# EasyEDA Pro project ProProject_无线温湿度检测系统1_2024-10-27.epro, board PCB1
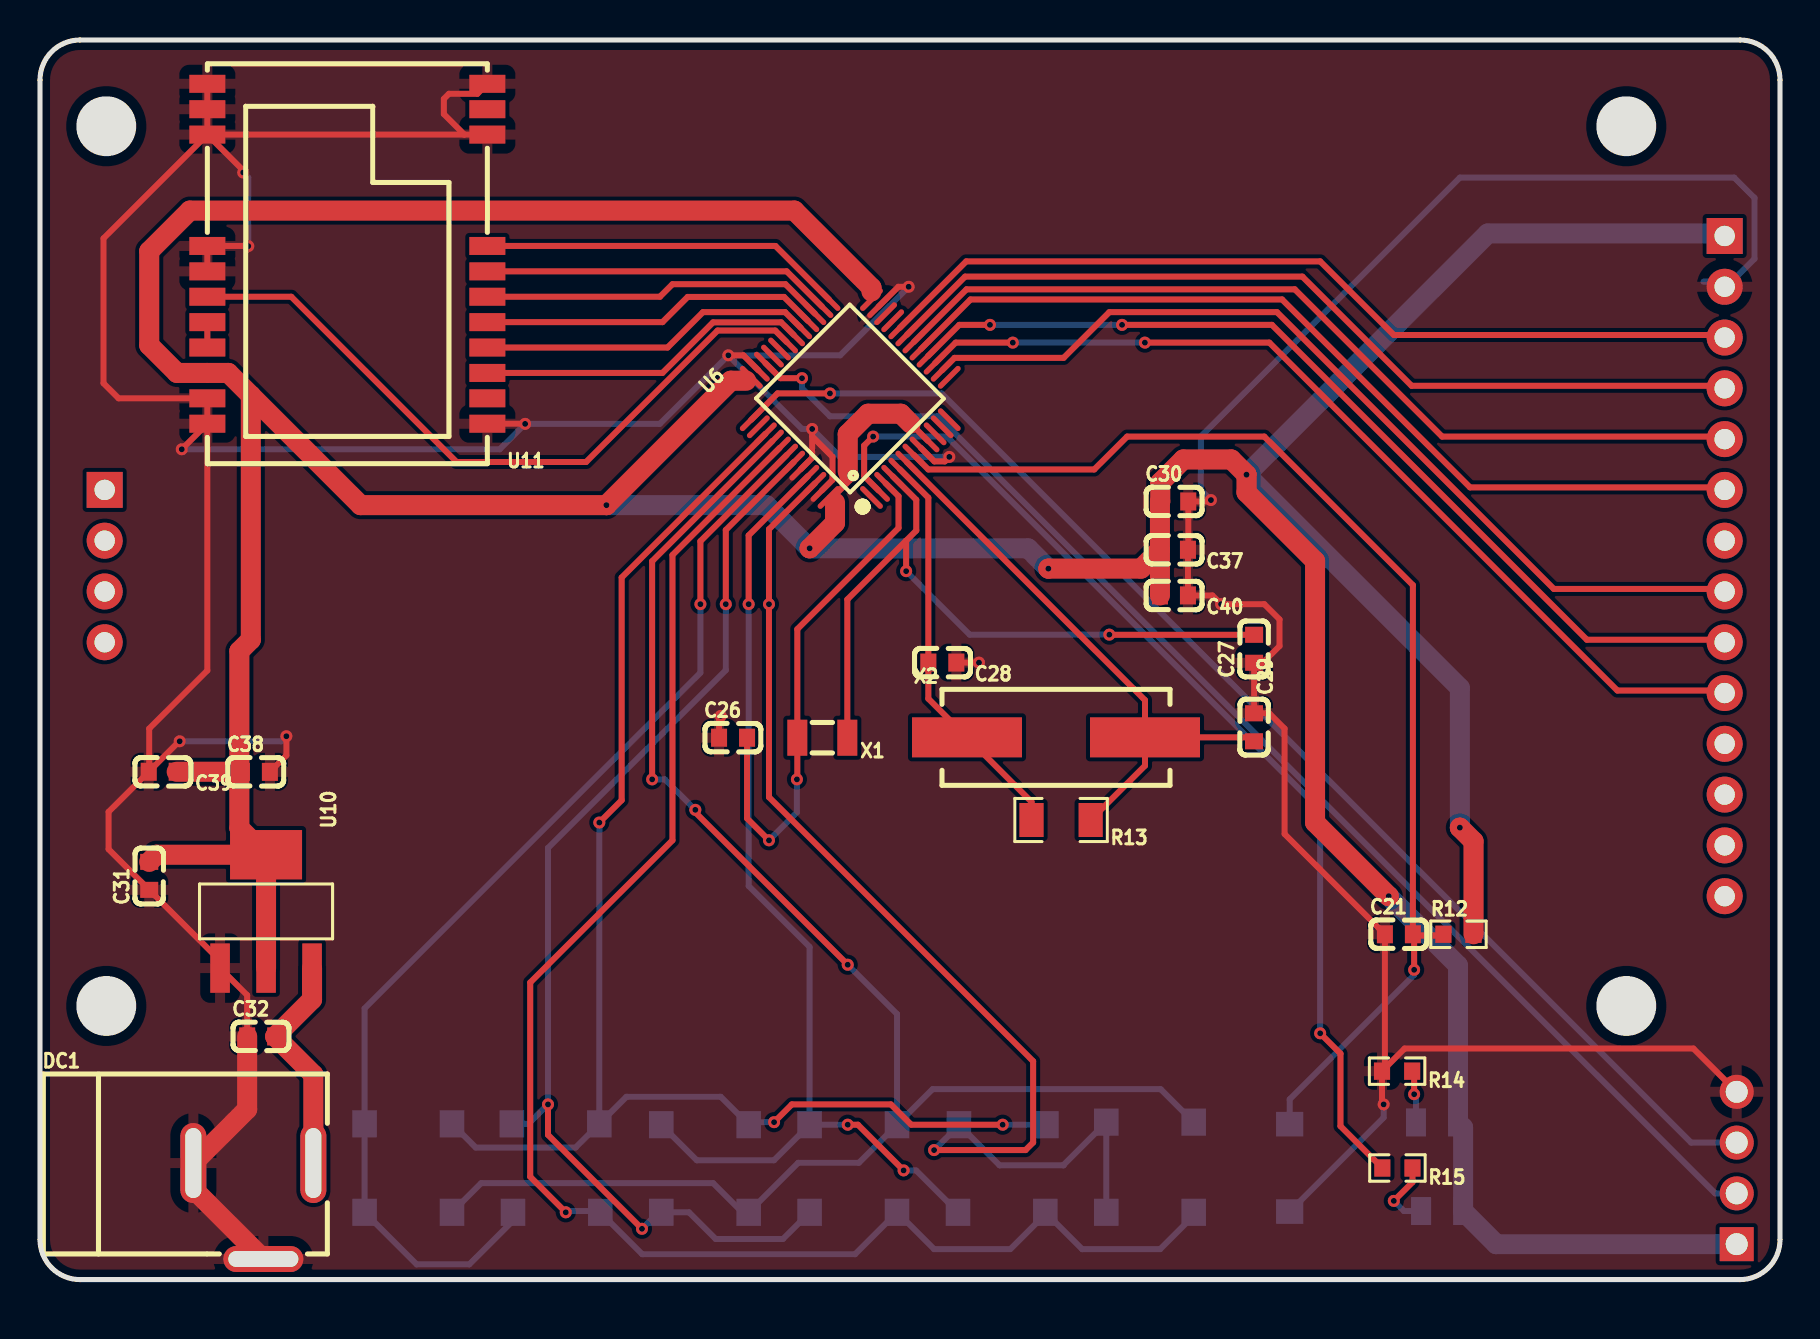
[diagram p9: board, top side]
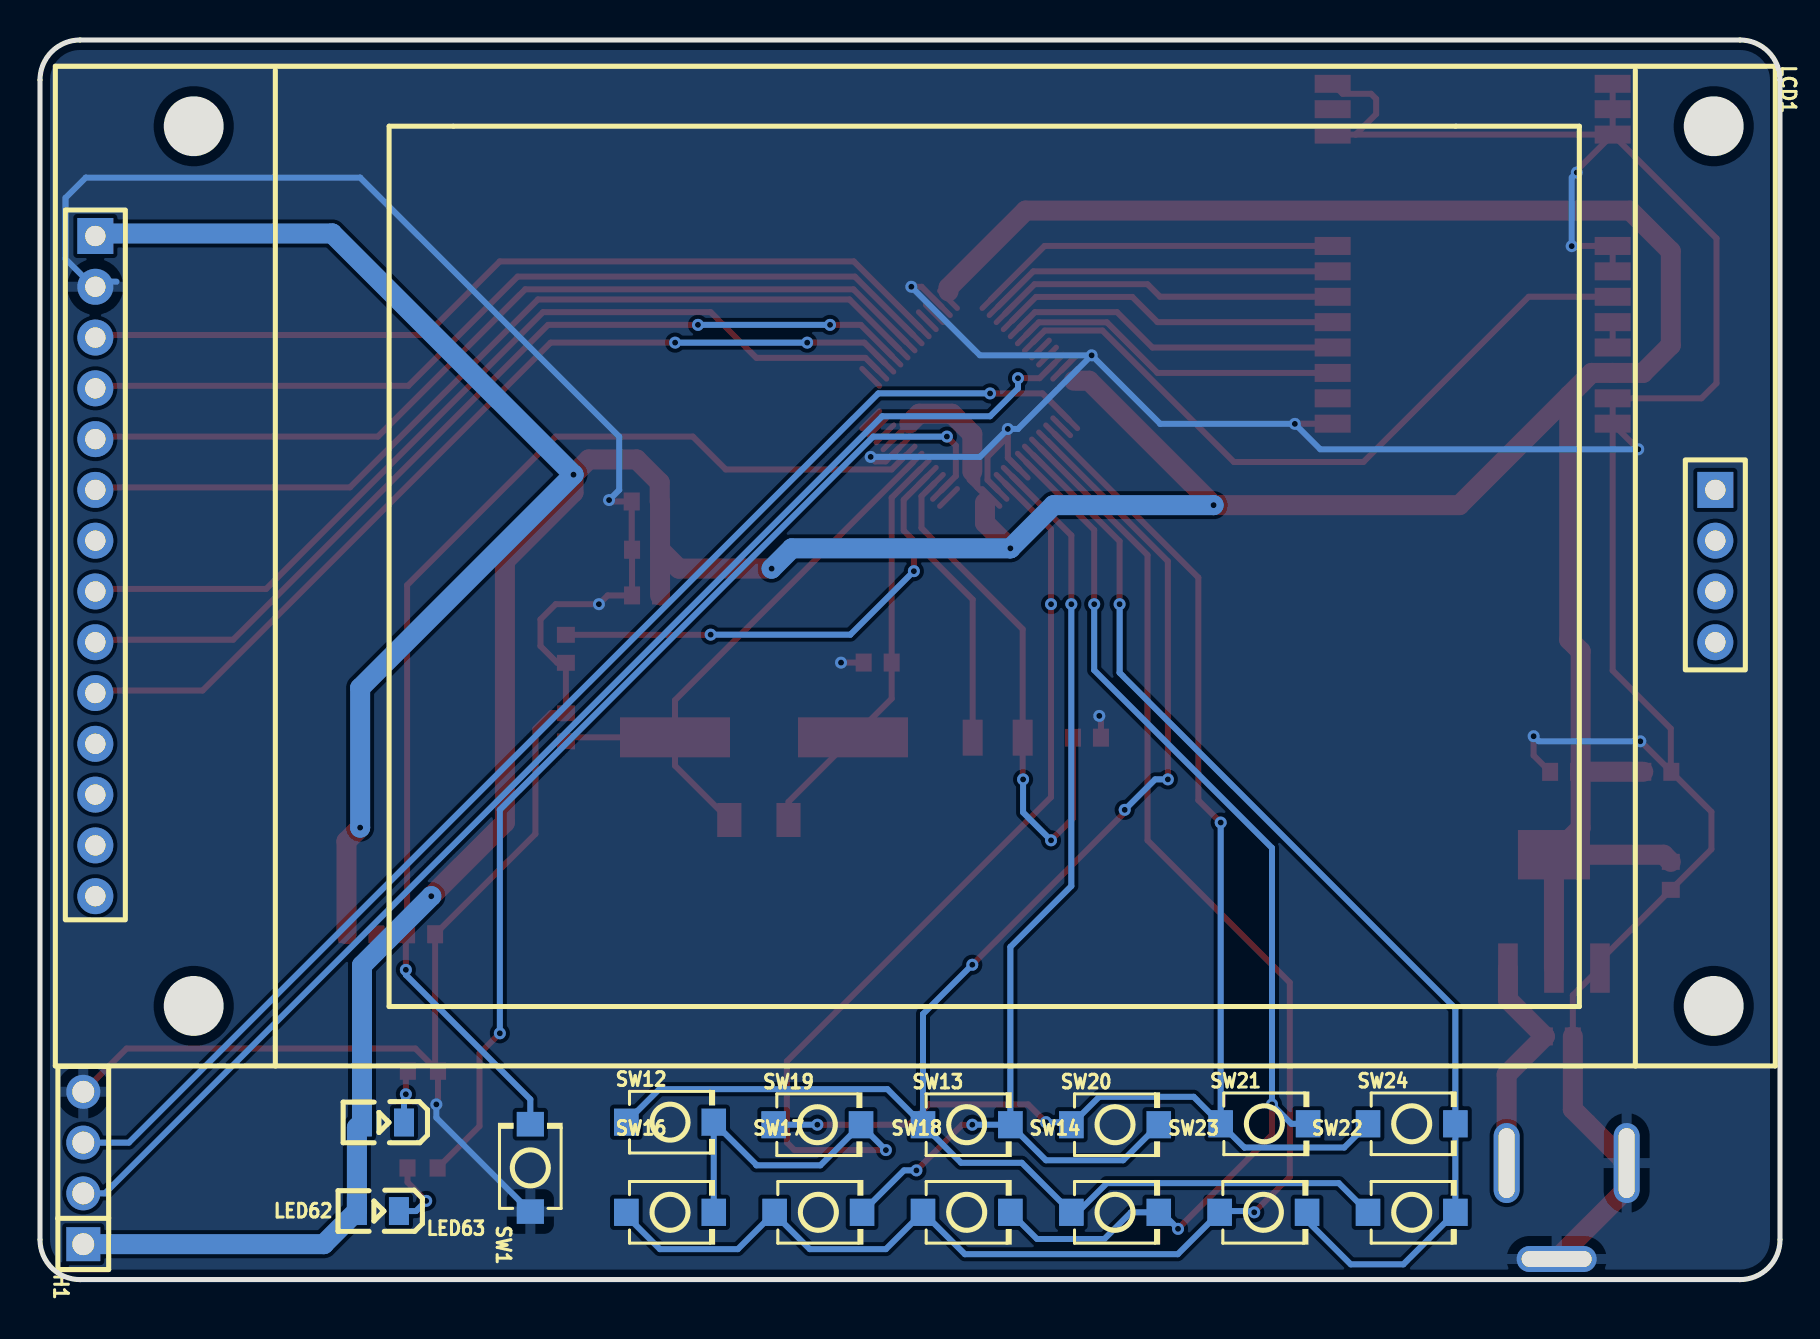
[diagram p10: board, bottom side, seen from below]

Outline 87 x 62 mm; copper layers: Top Layer, Inner1, Inner2, Bottom Layer. Coordinates in mm from the lower left corner of the outline.
Outline path: 0,60 0,2 arc(0.59,0.59) 2,0 85,0 arc(86.41,0.59) 87,2 87,60 arc(86.41,61.41) 85,62 2,62 arc(0.59,61.41) 0,60
Stack: Top Layer 0.035mm 外层铜厚1oz / Dielectric1 0.2104mm 7628 RC49% 8.6mil / Inner1 0.0152mm 内层铜厚 / Dielectric2 1.065mm 1.1mm H/HOZ 含铜 / Inner2 0.0152mm 内层铜厚 / Dielectric3 0.2104mm 7628 RC49% 8.6mil / Bottom Layer 0.035mm 外层铜厚1oz

## Design rules (mm)
template: JLCPCB Capability(Two Layers Board)
spacing copperThickness1oz (default): track to track 0.102, other pairs 0.152 to 0.3
spacing copperThickness2oz: track to track 0.203, other pairs 0.152 to 0.3
track width copperThickness1oz (default): min 0.127, default 0.254, max 2.54
track width copperThickness2oz: min 0.203, default 0.254, max 2.54
differential pair differentialPair (default): width min 0.127, default 0.254, max 2.54; gap min 0.152, default 0.152
via viaSize (default): diameter min 0.5, default 0.61, max 10; hole min 0.3, default 0.305, max 6.3

## Placement (name value [footprint] x y rotation side)
C21  1uF  [C0603]  67.94 17.27 0 top
C26  20pF  [C0603]  34.65 27.1 0 top
C27  20pF  [C0603]  60.71 31.55 90 top
C28  20pF  [C0603]  45.12 30.86 180 top
C29  20pF  [C0603]  60.7 27.62 270 top
C30  100nF  [C0603]  56.71 38.92 0 top
C31  1uF  [C0603]  5.46 20.19 90 top
C32  1uF  [C0603]  11.06 12.16 0 top
C37  100nF  [C0603]  56.7 36.5 180 top
C38  100nF  [C0603]  10.8 25.39 0 top
C39  100nF  [C0603]  6.14 25.4 180 top
C40  100nF  [C0603]  56.7 34.22 180 top
DC1  DC-005 2.0  [DC-IN-TH_DC-5520-1]  10.67 3.43 0 top
H1  烧录  [HDR-TH_4P-P2.54-V-M]  84.84 5.58 90 bottom
LCD1  HS280S010B  [LCD-TH_HS280S010B]  43.73 35.69 270 bottom
LED62  NCD0805R1  [LED0805-R-RD]  69.85 7.86 0 bottom
LED63  NCD0805R1  [LED0805-R-RD]  70.1 3.43 0 bottom
R12  10kΩ  [R0603]  70.92 17.27 0 top
R13  1mΩ  [R1206]  51.05 22.99 180 top
R14  510Ω  [R0603]  67.85 10.43 180 top
R15  510Ω  [R0603]  67.87 5.58 180 top
SW1  TS-1088R-02026  [SW-SMD_L3.9-W3.0-P4.45]  62.48 5.59 90 bottom
SW12  TS-1088-AR02016  [SW-SMD_L3.9-W3.0-P4.45]  55.5 7.87 180 bottom
SW13  TS-1088-AR02016  [SW-SMD_L3.9-W3.0-P4.45]  40.67 7.75 180 bottom
SW14  TS-1088-AR02016  [SW-SMD_L3.9-W3.0-P4.45]  33.25 3.37 180 bottom
SW16  TS-1088-AR02016  [SW-SMD_L3.9-W3.0-P4.45]  55.5 3.37 180 bottom
SW17  TS-1088-AR02016  [SW-SMD_L3.9-W3.0-P4.45]  48.08 3.37 180 bottom
SW18  TS-1088-AR02016  [SW-SMD_L3.9-W3.0-P4.45]  40.67 3.37 180 bottom
SW19  TS-1088-AR02016  [SW-SMD_L3.9-W3.0-P4.45]  48.13 7.75 180 bottom
SW20  TS-1088-AR02016  [SW-SMD_L3.9-W3.0-P4.45]  33.25 7.75 180 bottom
SW21  TS-1088-AR02016  [SW-SMD_L3.9-W3.0-P4.45]  25.78 7.79 180 bottom
SW22  TS-1088-AR02016  [SW-SMD_L3.9-W3.0-P4.45]  18.42 3.37 180 bottom
SW23  TS-1088-AR02016  [SW-SMD_L3.9-W3.0-P4.45]  25.83 3.37 180 bottom
SW24  TS-1088-AR02016  [SW-SMD_L3.9-W3.0-P4.45]  18.42 7.79 180 bottom
U6  STM32F103C8T6  [LQFP-48_L7.0-W7.0-P0.50-LS9.0-BL]  40.51 44.07 45 top
U10  AMS1117-3.3  [SOT-223-4_L6.5-W3.5-P2.30-LS7.0-BR]  11.3 18.42 270 top
U11  E22-400M22S  [WIRELM-SMD_E22-400M22S]  15.37 51.31 180 top
X1  32.768kHz  [FC-135R_L3.2-W1.5]  39.12 27.1 180 top
X2  8MHz  [CRYSTAL-SMD_L11.5-W4.8-LS12.7]  50.8 27.12 0 top

## Footprints (pads in the part's own frame, mm; a bottom-side part is the same pattern mirrored in y, then rotated)
C0603
  rect 0.8x0.9 smd: 1(-0.7,0) 2(0.7,0)
CRYSTAL-SMD_L11.5-W4.8-LS12.7
  rect 5.5x2 smd: 1(-4.45,0) 2(4.45,0)
DC-IN-TH_DC-5520-1
  oval 4x1.3 hole 3.5x0.8: 2(0.5,-2.4)
  oval 1.3x4 hole 0.8x3.5: 3(-3,2.4) 4(3,2.4)
FC-135R_L3.2-W1.5
  rect 1x1.8 smd: 1(-1.25,0) 2(1.25,0)
HDR-TH_4P-P2.54-V-M
  rect 1.7x1.7 hole 1.1: 1(-3.81,0)
  round 1.7 hole 1.1: 2(-1.27,0) 3(1.27,0) 4(3.81,0)
LCD-TH_HS280S010B
  rect 1.8x1.8 hole 1.02: 1(-16.51,-40.5) 15(-3.81,40.5)
  round 1.8 hole 1.02: 2(-13.97,-40.5) 3(-11.43,-40.5) 4(-8.89,-40.5) 5(-6.35,-40.5) 6(-3.81,-40.5) 7(-1.27,-40.5) 8(1.27,-40.5) 9(3.81,-40.5) 10(6.35,-40.5) 11(8.89,-40.5) 12(11.43,-40.5) 13(13.97,-40.5) 14(16.51,-40.5) 16(-1.27,40.5) 17(1.27,40.5) 18(3.81,40.5)
LED0805-R-RD
  rect 1x1.399 smd: 1(1.05,0) 2(-1.05,0)
LQFP-48_L7.0-W7.0-P0.50-LS9.0-BL
  oval 0.27x1.5 smd: 1(-2.75,-4.25) 2(-2.25,-4.25) 3(-1.75,-4.25) 4(-1.25,-4.25) 5(-0.75,-4.25) 6(-0.25,-4.25) 7(0.25,-4.25) 8(0.75,-4.25) 9(1.25,-4.25) 10(1.75,-4.25) 11(2.25,-4.25) 12(2.75,-4.25) 25(2.75,4.25) 26(2.25,4.25) 27(1.75,4.25) 28(1.25,4.25) 29(0.75,4.25) 30(0.25,4.25) 31(-0.25,4.25) 32(-0.75,4.25) 33(-1.25,4.25) 34(-1.75,4.25) 35(-2.25,4.25) 36(-2.75,4.25)
  oval 1.5x0.27 smd: 13(4.25,-2.75) 14(4.25,-2.25) 15(4.25,-1.75) 16(4.25,-1.25) 17(4.25,-0.75) 18(4.25,-0.25) 19(4.25,0.25) 20(4.25,0.75) 21(4.25,1.25) 22(4.25,1.75) 23(4.25,2.25) 24(4.25,2.75) 37(-4.25,2.75) 38(-4.25,2.25) 39(-4.25,1.75) 40(-4.25,1.25) 41(-4.25,0.75) 42(-4.25,0.25) 43(-4.25,-0.25) 44(-4.25,-0.75) 45(-4.25,-1.25) 46(-4.25,-1.75) 47(-4.25,-2.25) 48(-4.25,-2.75)
R0603
  rect 0.806x0.864 smd: 1(-0.753,0) 2(0.753,0)
R1206
  rect 1.208x1.701 smd: 1(-1.479,0) 2(1.479,0)
SOT-223-4_L6.5-W3.5-P2.30-LS7.0-BR
  rect 2.47x0.98 smd: 1(2.835,-2.3) 2(2.835,0) 3(2.835,2.3)
  rect 2.47x3.6 smd: 4(-2.835,0)
SW-SMD_L3.9-W3.0-P4.45
  rect 1.23x1.36 smd: 1(-2.185,0) 2(2.185,0)
WIRELM-SMD_E22-400M22S
  rect 1.8x0.9 smd: 1(7,-8.5) 2(7,-7.23) 3(7,-5.96) 4(7,-0.39) 5(7,0.88) 6(7,2.15) 7(7,3.42) 8(7,4.69) 9(7,5.96) 10(7,7.23) 11(7,8.5) 12(-7,8.5) 13(-7,7.23) 14(-7,5.96) 15(-7,4.69) 16(-7,3.42) 17(-7,2.15) 18(-7,0.88) 19(-7,-0.39) 20(-7,-5.96) 21(-7,-7.23) 22(-7,-8.5)

## Nets
As in the schematic.

Pads without a net: LCD1 7 11 12 13 14 15 16 17 18; U6 1 10 11 12 13 21 22 32 33 38; U11 13 21

## Via types
v1: diameter 1, hole 0.3, Top Layer to Bottom Layer, 6 vias
v2: diameter 0.6, hole 0.3, Top Layer to Bottom Layer, 46 vias

## Routing (per net, layer and track width the routed paths; a pad name or vN(x,y) marks a point on that pad's centre or on a via; arc(x,y) is an arc through that point)
12V: length 11.3
  Top Layer w1: U10.3 13.6,14.01 C32.2 13.67,10.25 DC1.4
GND: length 327.8
  Top Layer w0.3: v2(43.43,49.66) 42.92,49.66 41.93,48.67 ; 67.25,10.57 C21.1 62.23,22.29 62.23,27.56 61.47,28.32 C29.1 60.71,28.33 C27.1 61.14,30.85 61.98,31.69 61.98,33.02 61.21,33.78 v2(59.06,33.78) 58.62,34.22 C40.1 C37.1 57.41,36.52 57.41,38.92 58.48,38.92 v2(58.55,38.99) ; 67.25,10.57 R14.2 67.1,8.85 v2(67.18,8.76) ; 67.25,10.57 68.23,11.56 82.67,11.56 H1.4 ; 38.61,42.16 38.61,41.1 U6.44 ; 38.61,42.16 v2(38.61,42.55) ; 38.61,42.16 39.62,41.15 39.62,40 39.1,39.47 ; 5.46,25.43 6.96,26.92 v2(6.98,26.92) ; 5.46,25.43 C39.2 3.43,23.39 3.43,21.53 C31.1 9,15.95 U10.1 10.36,14.23 C32.1 ; 5.46,25.43 5.46,27.56 8.37,30.47 U11.11 ; v2(12.32,27.18) 12.32,26.22 C38.2 ; U11.1 U11.2 U11.3 ; v2(46.95,30.86) 46.95,30.86 C28.1 ; U11.11 U11.10 3.93,44.08 3.17,44.83 3.17,52.08 U11.3 ; U11.11 v2(7.09,41.53) ; 21.22,57.27 U11.20 ; 21.22,57.27 20.19,58.29 20.19,59.06 20.45,59.31 21.87,59.31 U11.22 ; 21.22,57.27 U11.3 ; v2(10.41,51.69) 10.41,51.7 U11.4 U11.5 ; C26.1 33.95,28.11 v2(34.04,28.19) ; v2(10.16,55.37) 10.16,55.47 U11.3 ; U6.8 44.72,40.92 45.24,40.92 v2(45.47,41.15) ; U11.12 24.25,42.81 v2(24.26,42.8) ; v2(34.42,46.23) 35.17,46.23 U6.35
  Top Layer w1: DC1.2 7.67,4.53 DC1.3 10.36,8.52 C32.1
  Inner1 w0.3: v2(46.95,30.86) 44.28,28.19 v2(34.04,28.19) ; v2(46.95,30.86) 56.13,30.86 v2(59.06,33.78) ; v2(46.95,30.86) 46.95,39.67 v2(45.47,41.15)
  Bottom Layer w0.3: v2(43.43,49.66) 40,46.23 v2(34.42,46.23) ; v2(34.42,46.23) 38.1,42.55 v2(38.61,42.55) 40,41.15 v2(45.47,41.15) ; v2(34.42,46.23) 30.99,42.8 v2(24.26,42.8) 22.99,41.53 v2(7.09,41.53) ; 83.17,49.91 84.58,49.91 85.72,51.05 85.72,54.1 84.71,55.12 70.99,55.12 58.04,42.16 58.04,39.5 v2(58.55,38.99) ; v2(67.18,8.76) 67.18,8.1 SW1.1 ; v2(10.16,55.37) 10.41,55.12 v2(10.41,51.69) ; v2(12.32,27.18) 12.06,26.92 v2(6.98,26.92)
VCC: length 282.4
  Top Layer w0.3: U6.9 43.53,42.82 ; 40.39,40.39 40.39,40.13 40.51,40 40.13,39.62 ; 40.13,39.62 39.73,39.22 39.73,38.97 ; 40.13,39.62 40.13,40.42
  Top Layer w1: v1(70.99,22.61) 71.68,21.92 R12.2 ; C37.2 56,38.9 C30.1 56.01,39.87 57.17,41.02 59.56,41.02 v1(60.32,40.26) 60.32,39.37 63.75,35.94 63.75,22.86 v1(67.44,19.18) ; C37.2 C40.2 ; C37.2 55.05,35.56 v1(50.42,35.56) ; v1(38.48,36.58) 39.75,37.85 39.75,38.86 ; 40.39,40.42 40.39,42.29 41.4,43.31 43.04,43.31 43.53,42.82 ; U10.2 U10.4 ; U10.4 9.97,22.58 9.97,25.33 ; U10.4 5.82,21.25 C31.2 ; 10.54,44.22 16.03,38.73 v1(28.32,38.73) 34.54,44.96 35.31,44.96 ; 10.54,44.22 10.54,32 9.97,31.43 9.97,25.33 ; 10.54,44.22 9.42,45.35 U11.9 6.85,45.35 5.46,46.74 5.46,51.44 7.49,53.47 37.72,53.47 41.57,49.61 41.57,49.42 ; 9.97,25.33 9.9,25.4 C39.1
  Bottom Layer w1: 84.19,52.32 72.39,52.32 v1(60.32,40.26) 70.99,29.59 v1(70.99,22.61) ; v1(50.42,35.56) 49.4,36.58 v1(38.48,36.58) 36.32,38.73 v1(28.32,38.73) ; H1.1 72.81,1.77 LED63.1 71.15,7.61 LED62.1 70.9,15.71 v1(67.44,19.18)
NRST: length 60.1
  Top Layer w0.3: 43.69,41.24 44.41,40.52 52.71,40.52 54.36,42.16 61.21,42.16 68.65,34.73 C21.2 68.71,17.21 ; 68.71,17.21 v2(68.71,15.49) ; 68.71,17.21 70.11,17.21 R12.1
  Bottom Layer w0.3: SW1.2 62.48,9.02 68.71,15.24 v2(68.71,15.49)
PA4/LED/BL: length 46
  Top Layer w0.3: 84.19,34.54 75.69,34.54 61.85,48.39 53.47,48.39 51.18,46.1 45.73,46.1 45.11,45.48
PA5/SPI1_SCK: length 47.1
  Top Layer w0.3: v2(48.64,46.86) 45.78,46.86 U6.15 ; v2(55.25,46.86) 61.47,46.86 78.87,29.46 84.19,29.46
  Bottom Layer w0.3: v2(48.64,46.86) v2(55.25,46.86)
PA6/SPI1_MISO: length 47
  Top Layer w0.3: U6.16 45.96,47.75 v2(47.5,47.75) ; 84.19,32 77.34,32 61.59,47.75 v2(54.1,47.75)
  Bottom Layer w0.3: v2(54.1,47.75) v2(47.5,47.75)
PA7/SPI1_MOSI: length 45.1
  Top Layer w0.3: 84.19,39.62 71.5,39.62 62.1,49.02 46.53,49.02 U6.17
PA8/NRST: length 16.7
  Top Layer w0.3: U11.15 31.38,46.62 33.15,48.39 37.26,48.39 U6.29
PA9/BUSY: length 16.6
  Top Layer w0.3: 37.68,47.25 37.06,47.88 33.66,47.88 31.12,45.35 U11.14
PA10/RXEN: length 35.3
  Top Layer w0.3: U6.31 36.76,47.47 33.88,47.47 27.31,40.89 20.83,40.89 12.56,49.16 U11.6
PB0/D/C: length 44.6
  Top Layer w0.3: 43.69,46.9 46.33,49.53 62.74,49.53 70.1,42.16 84.19,42.16
PB1/RST: length 44.3
  Top Layer w0.3: 84.19,44.7 68.58,44.7 63.12,50.17 46.26,50.17 43.34,47.25
PB2/CS: length 44.1
  Top Layer w0.3: 84.19,47.24 67.69,47.24 64.01,50.93 46.31,50.93 U6.20
PB12/SPI2_NSS: length 18.2
  Top Layer w0.3: U6.25 36.77,51.7 U11.19
PB13/SPI2_SCK: length 17.5
  Top Layer w0.3: U11.18 37.34,50.43 39.1,48.67
PB14/SPI2_MISO: length 17.2
  Top Layer w0.3: U6.27 37.27,49.78 31.62,49.78 31,49.16 U11.17
PB15/SPI2_MOSI: length 17
  Top Layer w0.3: U11.16 31.12,47.89 32.38,49.15 37.2,49.15 U6.28
PC13/TAMPER-RTC: length 52.5
  Top Layer w0.3: v2(41.66,42.16) 41.21,41.72 41.21,40.19 U6.2 ; R15.2 65.02,7.68 65.02,11.3 v2(64.01,12.32)
  Bottom Layer w0.3: v2(64.01,12.32) 64.01,23.5 45.34,42.16 v2(41.66,42.16)
PC14/OSC32_IN: length 26.4
  Top Layer w0.3: U6.3 42.93,39.18 42.93,37.59 37.87,32.53 X1.2 37.87,25.04 v2(37.85,25.02) ; v2(36.45,21.97) 35.35,23.07 C26.2
  Bottom Layer w0.3: v2(37.85,25.02) 37.85,23.37 v2(36.45,21.97)
PC15/OSC32_OUT: length 35.2
  Top Layer w0.3: 43.31,36.96 40.37,34.02 X1.1 ; 43.31,36.96 43.81,37.47 43.81,39 U6.4 ; 43.31,36.96 v2(43.31,35.43) ; v2(53.47,32.26) 53.47,32.25 C27.2
  Bottom Layer w0.3: v2(53.47,32.26) 46.48,32.26 v2(43.31,35.43)
PD0/OSC_IN: length 20.3
  Top Layer w0.3: U6.5 44.42,39.1 C28.2 44.42,29.05 X2.1 49.57,23.9 R13.2
PD1/OSC_OUT: length 29.5
  Top Layer w0.3: U6.6 55.25,28.98 X2.2 ; 52.53,22.99 55.25,25.7 X2.2 ; C29.2 60.5,27.12 X2.2
SWDCLK: length 65.3
  Top Layer w0.3: v2(39.5,44.32) 36.88,44.32 U6.37
  Bottom Layer w0.3: H1.3 82.56,6.85 45.09,44.32 v2(39.5,44.32)
SWDIO: length 66.1
  Top Layer w0.3: U6.34 37.02,45.08 v2(38.1,45.08)
  Bottom Layer w0.3: v2(38.1,45.08) 38.1,44.58 39.5,43.18 44.89,43.18 83.76,4.31 H1.2
X0: length 80.5
  Top Layer w0.3: U6.41 31.62,36.24 31.62,21.97 24.51,14.86 24.51,5.14 v2(26.29,3.37)
  Bottom Layer w0.3: 26.29,3.43 27.95,3.43 SW23.1 30.11,1.27 40.75,1.27 SW18.1 42.86,3.37 44.7,1.52 48.51,1.52 50.27,3.28 SW17.1 52.11,1.52 56.01,1.52 57.68,3.2 SW16.1
X1: length 83.7
  Top Layer w0.3: v2(32.77,23.5) 32.77,23.37 v2(40.39,15.75) ; U6.40 30.61,35.93 v2(30.61,25.02)
  Bottom Layer w0.3: SW22.1 22.06,4.83 33.66,4.83 35.12,3.37 SW14.1 37.91,5.84 40.95,5.84 SW13.1 ; SW12.1 56.03,9.53 44.63,9.53 SW13.1 ; SW13.1 42.85,13.28 v2(40.39,15.75) ; v2(32.77,23.5) 31.24,25.02 v2(30.61,25.02)
X2: length 70.6
  Top Layer w0.3: U6.39 29.08,35.11 29.08,23.98 v2(27.97,22.86) ; v2(48.13,7.75) 43.56,7.75 42.54,8.76 37.59,8.76 v2(36.7,7.87)
  Bottom Layer w0.3: SW21.1 v2(27.97,22.86) ; SW21.1 29.32,9.14 34.04,9.14 SW20.1 35.56,7.87 v2(36.7,7.87) ; SW21.1 26.78,6.6 21.79,6.6 SW24.1 ; v2(48.13,7.75) SW19.1
Y0: length 59.9
  Top Layer w0.3: U6.46 36.45,37.53 v2(36.45,33.78) 36.45,24.13 49.66,10.92 49.66,6.86 49.28,6.48 v2(44.7,6.48)
  Bottom Layer w0.3: v2(44.7,6.48) 45.95,7.72 SW19.2 47.98,5.72 51.18,5.72 51.18,5.74 SW12.2 SW16.2
Y1: length 53
  Top Layer w0.3: v2(35.43,33.78) 35.43,37.22 U6.45 ; v2(40.39,7.75) 40.89,7.75 v2(43.18,5.46)
  Bottom Layer w0.3: SW13.2 36.7,5.97 32.84,5.97 SW20.2 ; SW13.2 v2(40.39,7.75) ; SW13.2 38.48,16.64 35.43,19.69 v2(35.43,33.78) ; v2(43.18,5.46) 43.8,5.46 45.9,3.37
Y2: length 57.4
  Top Layer w0.3: v2(25.4,8.76) 25.4,7.24 v2(30.1,2.54) ; U6.43 34.29,37.49 v2(34.29,33.78)
  Bottom Layer w0.3: v2(34.29,33.78) 34.29,30.48 25.4,21.59 v2(25.4,8.76) 24.43,7.79 SW21.2 ; SW18.2 37.15,2.03 33.78,2.03 32.45,3.37 SW14.2 30.92,3.37 v2(30.1,2.54)
Y3: length 56.4
  Top Layer w0.3: v2(33.02,33.78) 33.02,36.93 U6.42
  Bottom Layer w0.3: v2(33.02,33.78) 33.02,30.35 16.23,13.56 SW24.2 SW22.2 18.83,0.76 21.46,0.76 23.65,2.95 23.65,3.37
$1N2757: length 2.6
  Top Layer w0.3: R14.1 68.71,10.33 v2(68.71,9.27)
  Bottom Layer w0.3: LED62.2 68.8,9.18 v2(68.71,9.27)
$1N2758: length 3.6
  Top Layer w0.3: v2(67.69,3.94) 68.62,4.87 R15.1
  Bottom Layer w0.3: v2(67.69,3.94) 68.2,3.43 LED63.2
$1N20193: length 1.3
  Top Layer w0.3: U11.7 U11.8

## Copper pours and planes (outline as drawn; the poured copper is in the pictures)
GND on Top Layer: -8.51,65.91 90.81,65.91 90.81,-3.94 -8.51,-3.94
GND on Bottom Layer: -5.97,72.64 93.98,72.64 93.98,-9.78 -5.97,-9.78
GND on Inner1: -4.06,75.56 89.92,75.56 89.92,-12.95 -4.06,-12.95
GND on Inner2: -19.81,68.2 104.52,68.2 104.52,-9.27 -19.81,-9.27
